# Altium project Fluxus.PrjPcb
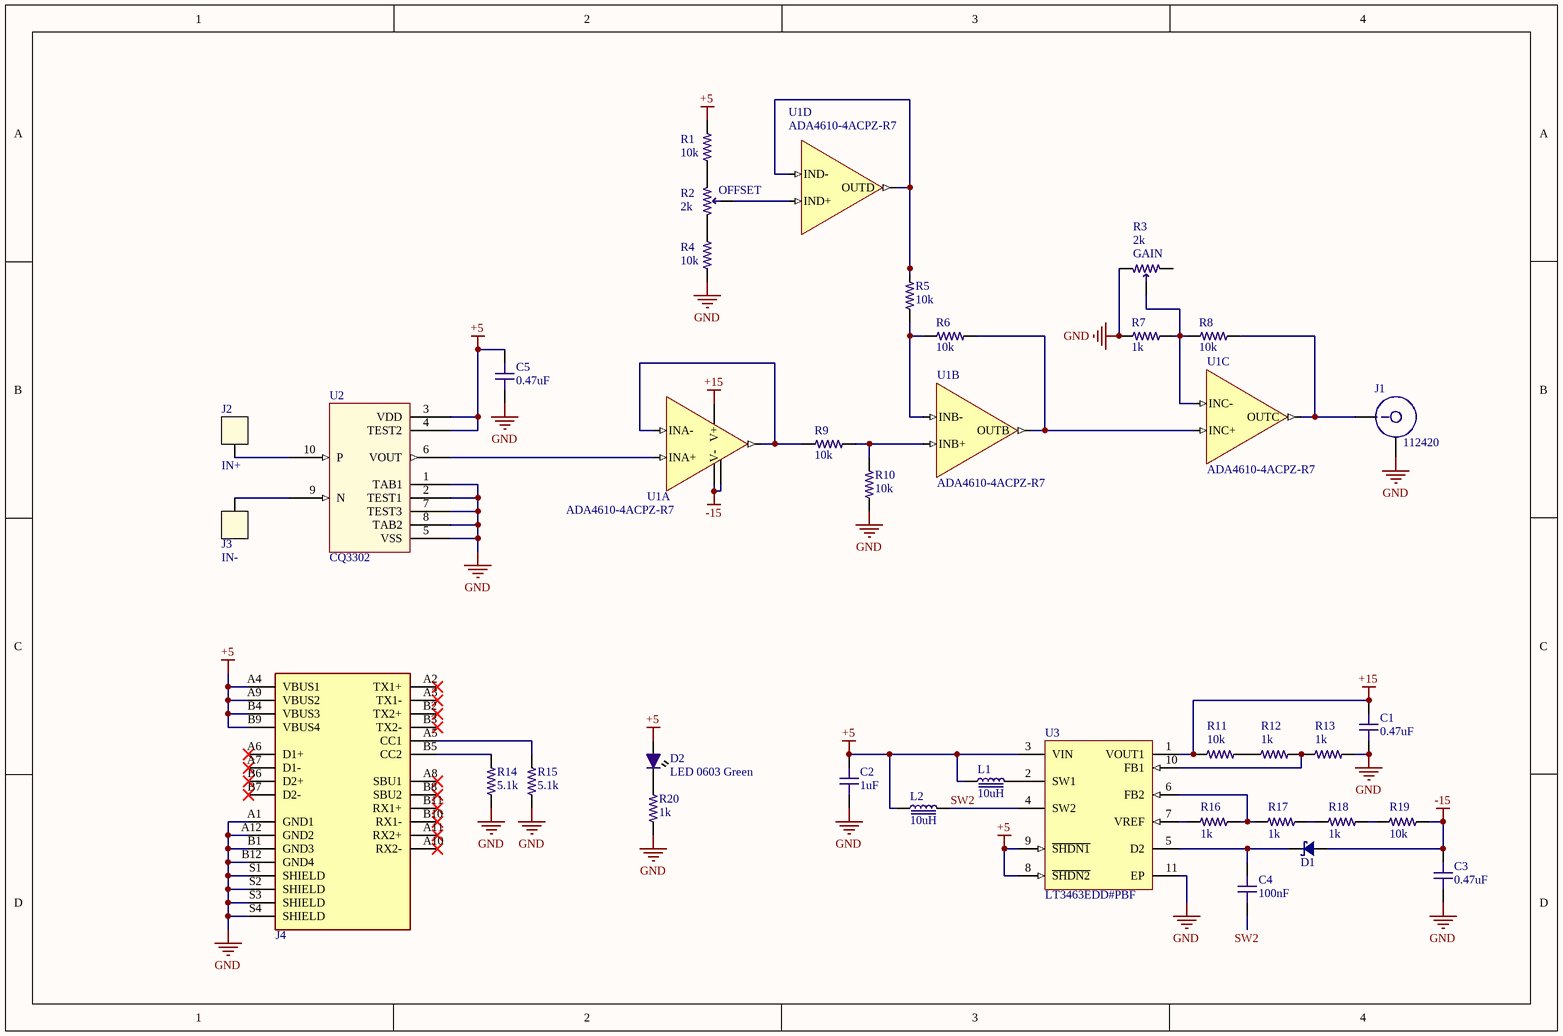
[diagram p0: Fluxus.SchDoc]
1 sheet, 36 parts. Net scope: global (net labels, ports and power ports of the same name join across sheets).
Board file: Fluxus.PcbDoc

## Sheet Fluxus.SchDoc
size A4; SheetNumber: 1; SheetTotal: 1

### Parts
C1  value 0.47uF  [C0603-HIGH-DENSITY]  (hidden comment: C0603 0.47uF 50V X7R)
C2  value 1uF  [C0603-HIGH-DENSITY]  (hidden comment: C0603 1uF 25V X7R)
C3  value 0.47uF  [C0603-HIGH-DENSITY]  (hidden comment: C0603 0.47uF 50V X7R)
C4  value 100nF  [C0603-HIGH-DENSITY]  (hidden comment: C0603 100nF 50V X7R)
C5  value 0.47uF  [C0603-HIGH-DENSITY]  (hidden comment: C0603 0.47uF 50V X7R)
D1  B0540WQ-7-F  [SOD123W]  (value not drawn)
D2  LED 0603 Green  [LED0603-IPC]
J1  112420  [BNC_Plug, Male Pin Panel Mount]
J2  IN+  [Banana Jack]
J3  IN-  [Banana Jack]
J4  USB C  [Molex USB-C]  (value not drawn)
L1  value 10uH  [LQH32C L1210]  (hidden comment: LQH32CN100K33L)
L2  value 10uH  [LQH32C L1210]  (hidden comment: LQH32CN100K33L)
R1  value 10k  [R0402-IPC]  (hidden comment: R0402 10k 1%)
R2  OFFSET  value 2k  [POT3.25-2]
R3  GAIN  value 2k  [POT3.25-2]
R4  value 10k  [R0402-IPC]  (hidden comment: R0402 10k 1%)
R5  value 10k  [R0402-IPC]  (hidden comment: R0402 10k 1%)
R6  value 10k  [R0402-IPC]  (hidden comment: R0402 10k 1%)
R7  value 1k  [R0402-IPC]  (hidden comment: R0402 1k 1%)
R8  value 10k  [R0402-IPC]  (hidden comment: R0402 10k 1%)
R9  value 10k  [R0402-IPC]  (hidden comment: R0402 10k 1%)
R10  value 10k  [R0402-IPC]  (hidden comment: R0402 10k 1%)
R11  value 10k  [R0402-IPC]  (hidden comment: R0402 10k 1%)
R12  value 1k  [R0402-IPC]  (hidden comment: R0402 1k 1%)
R13  value 1k  [R0402-IPC]  (hidden comment: R0402 1k 1%)
R14  value 5.1k  [R0603-HIGH-DENSITY]  (hidden comment: R0603 5.1K 1%)
R15  value 5.1k  [R0603-HIGH-DENSITY]  (hidden comment: R0603 5.1K 1%)
R16  value 1k  [R0402-IPC]  (hidden comment: R0402 1k 1%)
R17  value 1k  [R0402-IPC]  (hidden comment: R0402 1k 1%)
R18  value 1k  [R0402-IPC]  (hidden comment: R0402 1k 1%)
R19  value 10k  [R0402-IPC]  (hidden comment: R0402 10k 1%)
R20  value 1k  [R0402-IPC]  (hidden comment: R0402 1k 1%)
U1  ADA4610-4ACPZ-R7  [LFCSP16 4x4x0.75mm]  (parts A,B,C,D of 4)
U2  CQ3302  [24-LSSOP CQ3302 Specific]
U3  LT3463EDD#PBF  [DFN-10]

### Nets
+5: C2.2 C5.2 D2.A J4.A4(VBUS1) J4.A9(VBUS2) J4.B4(VBUS3) J4.B9(VBUS4) L1.1 L2.1 R1.2 U2.3(VDD) U2.4(TEST2) U3.3(VIN) U3.8(~{SHDN2}) U3.9(~{SHDN1})
+15: C1.2 R11.2 U1.3(V+) U3.1(VOUT1)
-15: C3.2 D1.2 R19.2 U1.10(V-) U1.17(PAD)
GND: C1.1 C2.1 C3.1 C5.1 J1.G J4.A1(GND1) J4.A12(GND2) J4.B1(GND3) J4.B12(GND4) J4.S1(SHIELD) J4.S2(SHIELD) J4.S3(SHIELD) J4.S4(SHIELD) R3.3 R4.1 R7.1 R10.2 R13.1 R14.1 R15.1 R20.1 U2.1(TAB1) U2.2(TEST1) U2.5(VSS) U2.7(TEST3) U2.8(TAB2) U3.11(EP)
SW2: C4.1 L2.2 U3.4(SW2)
NetC4_2: C4.2 D1.1 U3.5(D2)
NetD2_K: D2.K R20.2
NetJ1_C: J1.C R8.2 U1.7(OUTC)
NetJ2_1: J2.1 U2.10(P)
NetJ3_1: J3.1 U2.9(N)
NetJ4_A5: J4.A5(CC1) R15.2
NetJ4_B5: J4.B5(CC2) R14.2
NetL1_2: L1.2 U3.2(SW1)
NetR1_1: R1.1 R2.1
NetR2_2: R2.2(W) U1.11(IND+)
NetR2_3: R2.3 R4.2
NetR3_2: R3.2(W) R7.2 R8.1 U1.8(INC-)
NetR5_1: R5.1 U1.12(IND-) U1.14(OUTD)
NetR5_2: R5.2 R6.2 U1.5(INB-)
NetR6_1: R6.1 U1.6(OUTB) U1.9(INC+)
NetR9_1: R9.1 U1.1(INA-) U1.15(OUTA)
NetR9_2: R9.2 R10.1 U1.4(INB+)
NetR11_1: R11.1 R12.2
NetR12_1: R12.1 R13.2 U3.10(FB1)
NetR16_1: R16.1 R17.2 U3.6(FB2)
NetR16_2: R16.2 U3.7(VREF)
NetR17_1: R17.1 R18.2
NetR18_1: R18.1 R19.1
NetU1_2: U1.2(INA+) U2.6(VOUT)

Not connected (* = marked no-connect by the designer): J4 A2(TX1+)* A3(TX1-)* A6(D1+)* A7(D1-)* A8(SBU1)* A10(RX2-)* A11(RX2+)* B2(TX2+)* B3(TX2-)* B6(D2+)* B7(D2-)* B8(SBU2)* B10(RX1-)* B11(RX1+)*; R3 1

### Library data of the parts
C1 C3 C5 = C0603 0.47uF 50V X7R: Chip Capacitor, 0603, 0.47uF, 50V, X7R; EIA Code: X7R; Max. Voltage: 50V; Supplier 1: Digi-Key; Features: Soft Termination; Supplier Part Number 1: 445-172485-1-ND
C2 = C0603 1uF 25V X7R: CAP CER 1UF 25V X7R 0603; EIA Code: X7R; Max. Voltage: 25V; Features: Soft Termination; Supplier 1: Digi-Key; Supplier Part Number 1: 445-173615-1-ND
C4 = C0603 100nF 50V X7R: CAP CER 0.1UF 50V X7R 0603; EIA Code: X7R; Max. Voltage: 50V; Features: Soft Termination; Ratings: AEC-Q200; Supplier 1: Digi-Key; Supplier Part Number 1: 490-5798-1-ND
D1 = B0540WQ-7-F: DIODE SCHOTTKY 40V 500MA SOD123; Supplier 1: Digi-Key; Supplier 2: Mouser; Supplier 3: LCSC; Manufacturer Part No: B0540WQ-7-F; Supplier Part Number 1: B0540WQ-7-FDICT-ND; Supplier Part Number 2: 621-B0540WQ-7-F; Supplier Part Number 3: C460776
D2 = LED 0603 Green: LED GREEN CLEAR 0603 SMD; Supplier 1: Digi-Key; Supplier Part Number 1: 732-4971-1-ND
J1 = BNC: BNC Connector Plug, Male Pin 50Ohm Panel Mount Solder Cup; Supplier 1: Digi-Key; Supplier 2: Mouser; Supplier Part Number 1: ACX1407-ND; Supplier Part Number 2: 523-112420
J2 J3 = Banana Jack: JACK NON-INSULATED .350"; Supplier 1: Digi-Key; Supplier Part Number 1: 36-575-8-ND
J4 = USB C: USB-C USB 3.1 Gen 2, Superspeed+_ Receptacle Connector 24 Position Surface Mount, Right Angle; Through Hole; MF: Molex; MP: 1054500101; Package: None; Digi-Key_Part_Number: WM12856CT-ND; SnapEDA_Link: https://www.snapeda.com/parts/1054500101/Molex/view-part/448528/?ref=snap; Digi-Key_Purchase_URL: https://www.digikey.tw/product-detail/en/molex/1054500101/WM12856CT-ND/5843891?utm_source=snapeda&utm_medium=aggregator&utm_campaign=symbol; Value: *; Supplier 1: Digi-Key; Supplier 2: Mouser; Supplier 3: LCSC; Supplier Part Number 1: WM12856CT-ND; Supplier Part Number 2: 538-105450-0101; Supplier Part Number 3: C134092
L1 L2 = LQH32CN100K33L: FIXED IND 10UH 450MA 390 MOHM, UNSHIELDED WIREWOUND; Saturation Current: 450 mA; Supplier 1: Digi-Key; Supplier 2: Mouser; Supplier 3: LCSC; Supplier Part Number 1: 490-6614-1-ND; Supplier Part Number 2: 81-LQH32CN100K33L; Supplier Part Number 3: C86069
R1 R4-R6 R8-R11 R19 = R0402 10k 1%: Chip Resistor, 0402, 10k ohms, 1%, 1/16 W; Supplier 1: Digi-Key; Supplier Part Number 1: 311-10.0KLRCT-ND
R2 R3 = RPot: Surface Mount Trimmer; Supplier 1: Digi-Key; Supplier Part Number 1: TC33X-202ECT-ND; Supplier 2: Mouser; Supplier Part Number 2: 652-TC33X-2-202E; Supplier 3: LCSC; Supplier Part Number 3: C720647
R7 R12 R13 R16-R18 R20 = R0402 1k 1%: Chip Resistor, 0402, 1k ohms, 1%, 1/16 W; Supplier 1: Digi-Key; Supplier Part Number 1: 311-1.00KLRCT-ND
R14 R15 = R0603 5.1K 1%: RES SMD 5.1K OHM 1% 1/10W 0603; Temperature Coefficient: ±100ppm/°C; Features: Automotive AEC-Q200; Operating Temperature: -55°C ~ 155°C; Supplier 1: Digi-Key; Supplier Part Number 1: RMCF0603FT5K10CT-ND
U1 = ADA4610-4ACPZ-R7: IC OPAMP JFET 4 CIRCUIT 16LFCSP; Supplier 1: Digi-Key; Supplier 2: Mouser; Supplier Part Number 1: ADA4610-4ACPZ-R7CT-ND; Supplier Part Number 2: 584-ADA4610-4ACPZ-R7; Supplier Part Number 3: C654151; Supplier 3: LCSC
U2 = CQ3302: Current Sensor 21A Channel Hall Effect, Open Loop Bidirectional 24-LSSOP (0.220", 5.60mm Width), 10 Leads; Supplier 1: Digi-Key; Supplier Part Number 1: 974-1088-1-ND; Supplier 3: LCSC; Supplier Part Number 3: C133176
U3 = LT3463EDD: Dual Micropower DC/DC Converters with Schottky Diodes, 2.4 to 15 V Vin, 10-pin SON (DD-10), -40 to 85 degC, Pb-Free; Manufacturer: Linear Technology; Manufacturer: Analog Devices / Linear Technology; Number of Outputs: 2; Vin Max(V): 15; Vin Min(V): 2.4; ComponentLink1URL: http://www.linear.com/; ComponentLink3Description: Package Specification; RoHS: TRUE; ComponentLink2URL: http://cds.linear.com/docs/en/datasheet/3463f.pdf; PackageReference: DD-10; Mounting Technology: Surface Mount; Code_JEDEC: MO-229; PartNumber: LT3463EDD#PBF; ComponentLink1Description: Manufacturer URL; ComponentLink2Description: Datasheet; PackageVersion: Rev. C, 06/2010; PackageDescription: 10-Pin Plastic DFN, Body 3 x 3 mm, Pitch 0.5 mm; ComponentLink3URL: http://cds.linear.com/docs/en/packaging/DFN_10_05-08-1699.pdf; Manufacturer Part Number: LT3463EDD#PBF; Supplier 1: Digi-Key; Supplier 2: Mouser; Supplier Part Number 1: LT3463EDD#PBF-ND; Supplier Part Number 2: 584-LT3463EDD#PBF